# Altium schematic sheet 02_NRF52832.SchDoc: WMI (BLE)
size A4
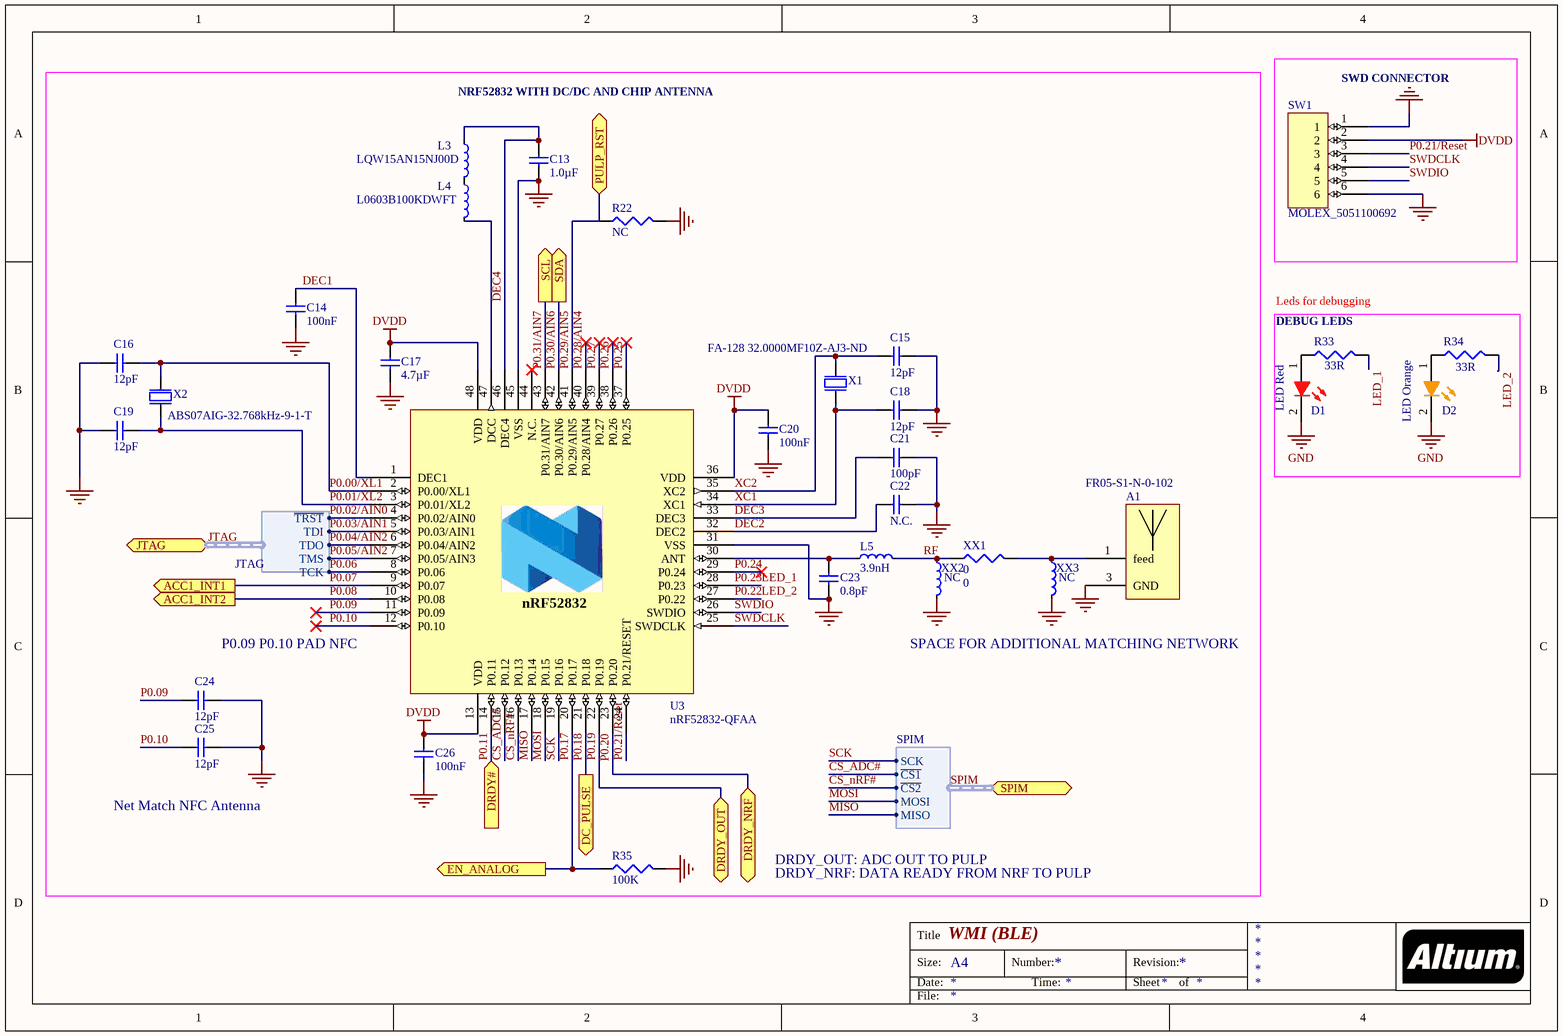
[diagram p0: 02_NRF52832.SchDoc]

## Parts
A1  FR05-S1-N-0-102  [DFN510P700X220-2N]
C13  1.0µF  [CAPC1608X06L]
C14  100nF  [CAPC1005X04L]
C15  12pF  [CAPC1005X04L]
C16  12pF  [CAPC1005X04L]
C17  4.7µF  [CAPC1608X06L]
C18  12pF  [CAPC1005X04L]
C19  12pF  [CAPC1005X04L]
C20  100nF  [CAPC1005X04L]
C21  100pF  [CAPC1005X04L]
C22  N.C.  [CAPC1005X04L]
C23  0.8pF  [CAPC1005X04L]
C24  12pF  [0402]
C25  12pF  [0402]
C26  100nF  [CAPC1005X04L]
D1  LED Red  [DIOC1608X08L]
D2  LED Orange  [DIOC1608X08L]
L3  LQW15AN15NJ00D  [INDC1005X04L]
L4  L0603B100KDWFT  [J1-0603]
L5  3.9nH  [INDC1005X04L]
R22  NC  [0402]  (graphical)
R33  value 33R  [J1-0603]
R34  value 33R  [J1-0603]
R35  100K  [0402]
SW1  MOLEX_5051100692  [MOLEX_5051100692]
U3  nRF52832-QFAA  [QFN40P600X600X90-48N]
X1  FA-128 32.0000MF10Z-AJ3-ND  [BT-XTAL_2016]
X2  ABS07AIG-32.768kHz-9-1-T  [XTAL_3215]
XX1  0  [0402]
XX2  NC  [INDC1005X04L]
XX3  NC  [INDC1005X04L]

## Blocks framed on the sheet
SWD CONNECTOR: SW1
DEBUG LEDS: D1 D2 R33 R34

## Ports
ACC1_INT1 (out), ACC1_INT2 (out), DC_PULSE (out), DRDY# (in), DRDY_NRF (bidir), DRDY_OUT (bidir), EN_ANALOG (out), JTAG (harness JTAG), PULP_RST (bidir), SCL (out), SDA (out), SPIM (harness SPIM)

## Harnesses
SPIM: SCK, ~{CS1}, ~{CS2}, MOSI, MISO
JTAG: ~{TRST}, TCK, TMS, TDI, TDO

## Nets
DVDD: C17.1 C20.1 C26.1 SW1.2 U3.13(VDD) U3.36(VDD) U3.48(VDD)
GND: A1.3(GND) C13.1 C14.2 C15.2 C16.2 C17.2 C18.2 C19.2 C20.2 C21.2 C22.1 C23.1 C24.1 C25.1 C26.2 D1.2(K) D2.2(K) R22.2 R35.2 SW1.1 SW1.6 U3.31(VSS) U3.45(VSS) U3.49(GND) X1.2(GND) X1.4(GND) XX2.2 XX3.2
CS_ADC#: U3.15(P0.12) ; port SPIM.~{CS1}
CS_nRF#: U3.16(P0.13) ; port SPIM.~{CS2}
DEC1: C14.1 U3.1(DEC1)
DEC2: C22.2 U3.32(DEC2)
DEC3: C21.1 U3.33(DEC3)
DEC4: C13.2 L3.1 U3.46(DEC4)
LED_1: R33.2 U3.28(P0.23)  [also labelled P0.23]
LED_2: R34.2 U3.27(P0.22)  [also labelled P0.22]
MISO: U3.17(P0.14) ; port SPIM.MISO
MOSI: U3.18(P0.15) ; port SPIM.MOSI
P0.00/XL1: C16.1 U3.2(P0.00/XL1) X2.1(inp)
P0.01/XL2: C19.1 U3.3(P0.01/XL2) X2.2(out)
P0.02/AIN0: U3.4(P0.02/AIN0) ; port JTAG.~{TRST}  [project net JTAG.~{TRST}]
P0.03/AIN1: U3.5(P0.03/AIN1) ; port JTAG.TDI  [project net JTAG.TDI]
P0.04/AIN2: U3.6(P0.04/AIN2) ; port JTAG.TDO  [project net JTAG.TDO]
P0.05/AIN2: U3.7(P0.05/AIN3) ; port JTAG.TMS  [project net JTAG.TMS]
P0.06: U3.8(P0.06) ; port JTAG.TCK  [project net JTAG.TCK]
P0.07: U3.9(P0.07) ; port ACC1_INT1
P0.08: U3.10(P0.08) ; port ACC1_INT2
P0.09: C24.2 U3.11(P0.09)
P0.10: C25.2 U3.12(P0.10)
P0.11: U3.14(P0.11) ; port DRDY#
P0.17: R35.1 U3.20(P0.17) ; port EN_ANALOG
P0.18: U3.21(P0.18) ; port DC_PULSE
P0.19: U3.22(P0.19) ; port DRDY_OUT
P0.20: U3.23(P0.20) ; port DRDY_NRF
P0.21/Reset: SW1.3 U3.24(P0.21/RESET)
P0.24: U3.29(P0.24)
P0.25: U3.37(P0.25)
P0.26: U3.38(P0.26)
P0.27: U3.39(P0.27)
P0.28/AIN4: U3.40(P0.28/AIN4)
P0.29/AIN5: R22.1 U3.41(P0.29/AIN5) ; port PULP_RST
P0.30/AIN6: U3.42(P0.30/AIN6) ; port SDA
P0.31/AIN7: U3.43(P0.31/AIN7) ; port SCL
RF: L5.2 XX1.1 XX2.1
SCK: U3.19(P0.16) ; port SPIM.SCK
SWDCLK: SW1.4 U3.25(SWDCLK)
SWDIO: SW1.5 U3.26(SWDIO)
XC1: C18.1 U3.34(XC1) X1.1(inp)
XC2: C15.1 U3.35(XC2) X1.3(out)
NetA1_1: A1.1(feed) XX1.2 XX3.1
NetC23_2: C23.2 L5.1 U3.30(ANT)
NetD1_1: D1.1(A) R33.1
NetD2_1: D2.1(A) R34.1
NetL3_2: L3.2 L4.1
NetL4_2: L4.2 U3.47(DCC)

Not connected (* = marked no-connect by the designer): A1 2(not_connected); U3 44(N.C.)*

## Buses and harness runs
harness JTAG = port JTAG
harness SPIM = port SPIM

## Notes on the sheet
- NRF52832 WITH DC/DC AND CHIP ANTENNA
- Leds for debugging
- P0.09 P0.10 PAD NFC
- SPACE FOR ADDITIONAL MATCHING NETWORK
- (near C25) Net Match NFC Antenna
- DRDY_OUT: ADC OUT TO PULP
- DRDY_NRF: DATA READY FROM NRF TO PULP
- Title
- Size:
- Date:
- A4
- Number:
- Time:
- Revision:
- Sheet
- of
- File:
- (in symbol nRF52832-QFAB) nRF52832

## Library data of the parts
A1 = FR05-S1-N-0-102: Bluetooth antenna
C13 = C0603-1µ0: Capacitor, X7R, ±10%; Note: 16V; Artikkelnr Noca: 20039335; Artikkelnr Simpro: N.A.; Part Number: C0603-1µ0; Manufacturer: *; Manufacturer Part Number: *; Datasheet: *; LatestRevisionDate: 2013-06-05; Pin Count: 2; Publisher: Nordic Semiconductor; Published: 2009-05-08; Value: 1.0µF; Supplier: *; Supplier part number: *; 2nd source Supplier: *; 2nd source part number: *; Footprint Doc: 0603
C14 C20 C26 = C0402-100n: Capacitor, X7R, ±10%; Note: 16V; Artikkelnr Noca: 20039200; Artikkelnr Simpro: N.A.; Part Number: C0402-100n; Manufacturer: *; Manufacturer Part Number: *; Datasheet: *; LatestRevisionDate: 2009-11-23; Pin Count: 2; Publisher: Nordic Semiconductor; Published: 2009-05-08; Value: 100nF; Supplier: *; Supplier part number: *; 2nd source Supplier: *; 2nd source part number: *; Footprint Doc: 0402
C15 C16 C18 C19 C24 C25 = C0402-12p: Capacitor, NP0, ±2%; Note: 50V; Artikkelnr Noca: 20029159; Artikkelnr Simpro: N.A.; Part Number: C0402-12p; Manufacturer: *; Manufacturer Part Number: *; Datasheet: *; LatestRevisionDate: 2011-05-11; Pin Count: 2; Publisher: Nordic Semiconductor; Published: 2009-05-08; Value: 12pF; Supplier: *; Supplier part number: *; 2nd source Supplier: *; 2nd source part number: *; Footprint Doc: 0402
C17 = C0603-4µ7: Capacitor, X5R, ±10%; Note: 6.3V; Artikkelnr Noca: 20069060; Artikkelnr Simpro: N.A.; Part Number: C0603-4µ7; Manufacturer: *; Manufacturer Part Number: *; Datasheet: *; LatestRevisionDate: 2009-11-23; Pin Count: 2; Publisher: Nordic Semiconductor; Published: 2009-05-08; Value: 4.7µF; Supplier: *; Supplier part number: *; 2nd source Supplier: *; 2nd source part number: *; Footprint Doc: 0603
C21 = C0402-100p: Capacitor, NP0, ±5%; Note: 50V; Artikkelnr Noca: 20029135; Artikkelnr Simpro: N.A.; Part Number: C0402-100p; Manufacturer: *; Manufacturer Part Number: *; Datasheet: *; LatestRevisionDate: 2009-05-08; Pin Count: 2; Publisher: Nordic Semiconductor; Published: 2009-05-08; Value: 100pF; Supplier: *; Supplier part number: *; 2nd source Supplier: *; 2nd source part number: *; Footprint Doc: 0402
C22 = C0402-N.C.: Not mounted; Note: Chip Cap; Artikkelnr Noca: N.A.; Part Number: C0402-N.C.; Manufacturer: *; Manufacturer Part Number: *; Datasheet: *; LatestRevisionDate: 2009-05-08; Pin Count: 2; Publisher: Nordic Semiconductor; Published: 2009-05-08; Value: N.C.; Supplier: *; Supplier part number: *; 2nd source Supplier: *; 2nd source part number: *; Footprint Doc: 0402; Artikkelnr Simpro: N.A.
C23 = C0402-0.8p: Capacitor, NP0, ±5%; Note: 50V; Artikkelnr Noca: 20029147; Artikkelnr Simpro: N.A.; Part Number: C0402-0.8p; Manufacturer: *; Manufacturer Part Number: *; Datasheet: *; LatestRevisionDate: 2012-11-21; Pin Count: 2; Publisher: Nordic Semiconductor; Published: 2009-05-08; Value: 0.8pF; Supplier: *; Supplier part number: *; 2nd source Supplier: *; 2nd source part number: *; Footprint Doc: 0402
D1 = KING-LED-RED-APT1608LSECK/J3-PRV: 1.6X0.8mm SMD CHIP LED LAMP, Hyper Red; Part Number: APT1608LSECK/J4-PRV; Forward Voltage: 1.8V; Test Current: 2mA; ComponentLink1Description: Datasheet; ComponentLink1URL: http://www.kingbrightusa.com/images/catalog/SPEC/APT1608LSECK-J3-PRV.pdf; Supplier 1: Digi-Key; Supplier 2: Mouser; Supplier 3: Digi-Key; Supplier 4: Digi-Key; Supplier Part Number 1: 754-1930-6-ND; Supplier Part Number 2: 604-APT1608LSECKJ3RV; Supplier Part Number 3: 754-1930-1-ND; Supplier Part Number 4: 754-1930-2-ND
D2 = KING-LED-ORANGE-APT1608LSECK/J4-PRV: 1.6X0.8mm SMD CHIP LED LAMP, Super Bright Orange; Forward Voltage: 1.8V; Test Current: 2mA; Part Number: APT1608LSECK/J4-PRV; ComponentLink1Description: Datasheet; ComponentLink1URL: http://www.kingbrightusa.com/images/catalog/SPEC/APT1608LSECK-J4-PRV.pdf; Supplier 1: Digi-Key; Supplier 2: Digi-Key; Supplier 3: Mouser; Supplier 4: Digi-Key; Supplier Part Number 1: 754-1931-6-ND; Supplier Part Number 2: 754-1931-1-ND; Supplier Part Number 3: 604-APT1608LSECKJ4RV; Supplier Part Number 4: 754-1931-2-ND
L3 = L0402-15n: High frequency chip inductor ±10%; Manufacturer: Taiyo Yuden; Manufacturer Part Number: HK100515NJ-T; 2nd source part number: 658-1328; Value: 15nH; Artikkelnr Noca: 33029323; Artikkelnr Simpro: N.A.; Part Number: L0402-15n; LatestRevisionDate: 2012-09-19; Pin Count: 2; Publisher: Nordic Semiconductor; Published: 2010-07-12; Note: High frequency chip inductor ±10%; Supplier: Digi-Key; Datasheet: http://www.yuden.co.jp/productdata/catalog/en/mlci04_e.pdf; Supplier part number: 587-1521-1-ND; 2nd source Supplier: Farnell; Footprint Doc: 0402
L4 = L0603-10µ: Chip inductor, IDC,min = 50 mA, ±20%; Manufacturer: Taiyo Yuden; Manufacturer Part Number: LBMF1608T100K; 2nd source part number: 178-6105; Value: 10µH; Note: LBMF1608T100K 10µH 80mA 0603; Artikkelnr Noca: 33029314; Artikkelnr Simpro: N.A.; Part Number: L0603-10µ; Datasheet: http://www.yuden.co.jp/ut/product/pdf/elb2_e.pdf; LatestRevisionDate: 2012-09-19; Pin Count: 2; Publisher: Nordic Semiconductor; Published: 2010-02-24; Supplier: Digi-Key; Supplier part number: 587-1714-1-ND; 2nd source Supplier: Farnell; Footprint Doc: 0603
L5 = L0402-3n9: High frequency chip inductor ±5%; Manufacturer: Murata; Manufacturer Part Number: LQP15MN3N9B02D; Artikkelnr Noca: 33029151; Artikkelnr Simpro: N.A.; Part Number: L0402-3n9; Datasheet: http://search.murata.co.jp/Ceramy/image/img/PDF/ENG/L0075S0084LQP15M.pdf; LatestRevisionDate: 2012-09-19; Pin Count: 2; Publisher: Nordic Semiconductor; Published: 2009-05-08; Value: 3.9nH; Note: High frequency chip inductor ±5%; Supplier: Digi-Key; Supplier part number: 490-1131-1-ND; 2nd source Supplier: *; 2nd source part number: *; Footprint Doc: 0402
R22 R33-R35 XX1 = Res3: Resistor; Published: 8-Jun-2000; LatestRevisionDate: 29-May-2009; LatestRevisionNote: IPC-7351 Footprint Added.; PackageReference: J1-0603; Publisher: Altium Limited; PackageDescription: Chip Resistor
  R22: Value: NC
  R35: Value: 100K
  XX1: Value: 0
U3 = nRF52832-QFAB: Multi-protocol Bluetooth Low Energy, ANT and 2.4GHz proprietary system-on-chip; Manufacturer: Nordic Semiconductor; Artikkelnr Noca: N.A.; Part Number: nRF52832-QFAA; Manufacturer Part Number: nRF52832-QFAA; Datasheet: *; LatestRevisionDate: 2016-11-24; Pin Count: 48; Publisher: Nordic Semiconductor; Published: 2016-11-24; Value: nRF52832-QFAA; Note: *; Supplier: Nordic Semiconductor; Supplier part number: *; 2nd source Supplier: *; 2nd source part number: *; Footprint Doc: QFN-48; Artikkelnr Simpro: N.A.
X1 = XTAL_SMD2016_32MHz_8pF_General: XTAL SMD 2016, 32MHz, Cl=8pF, Total Tol: ±40ppm; Note: XTAL SMD 32.000MHz; Artikkelnr Noca: N.A.; Part Number: XTAL_SMD2016_32MHz_8pF_General; Manufacturer: *; Manufacturer Part Number: *; Datasheet: *; LatestRevisionDate: 2016-08-19; Pin Count: 4; Publisher: Nordic Semiconductor; Published: 2016-08-19; Value: 32MHz; Supplier: *; Supplier part number: *; 2nd source Supplier: *; 2nd source part number: *; Footprint Doc: XTAL_2016; Artikkelnr Simpro: N.A.
X2 = XTAL_SMD3215_32.768kHz_9pF_General: XTAL SMD 3215, 32.768kHz, Cl=9pF, Total Tol: ±50ppm; Note: XTAL SMD 32.768kHz; Artikkelnr Noca: N.A.; Part Number: XTAL_SMD3215_32.768kHz_9pF_General; Manufacturer: *; Manufacturer Part Number: *; Datasheet: *; LatestRevisionDate: 2016-08-19; Pin Count: 2; Publisher: Nordic Semiconductor; Published: 2016-08-19; Value: 32.768kHz; Supplier: *; Supplier part number: *; 2nd source Supplier: *; 2nd source part number: *; Footprint Doc: XTAL_3215; Artikkelnr Simpro: N.A.
XX2 XX3 = L0402-N.C.: Not mounted; Value: N.C.; Artikkelnr Noca: N.A.; Assembly: Not mounted; Part Number: L0402-N.C.; Manufacturer: *; Manufacturer Part Number: *; Datasheet: *; LatestRevisionDate: 2016-11-24; Pin Count: 2; Publisher: Nordic Semiconductor; Published: 2016-11-24; Note: *; Supplier: *; Supplier part number: *; 2nd source Supplier: *; 2nd source part number: *; Footprint Doc: 0402; Artikkelnr Simpro: N.A.; ComponentLink1Description: Datasheet; ComponentLink2Description: Supplier link